# Altium schematic sheet Control_Sig_old.SchDoc
size Letter
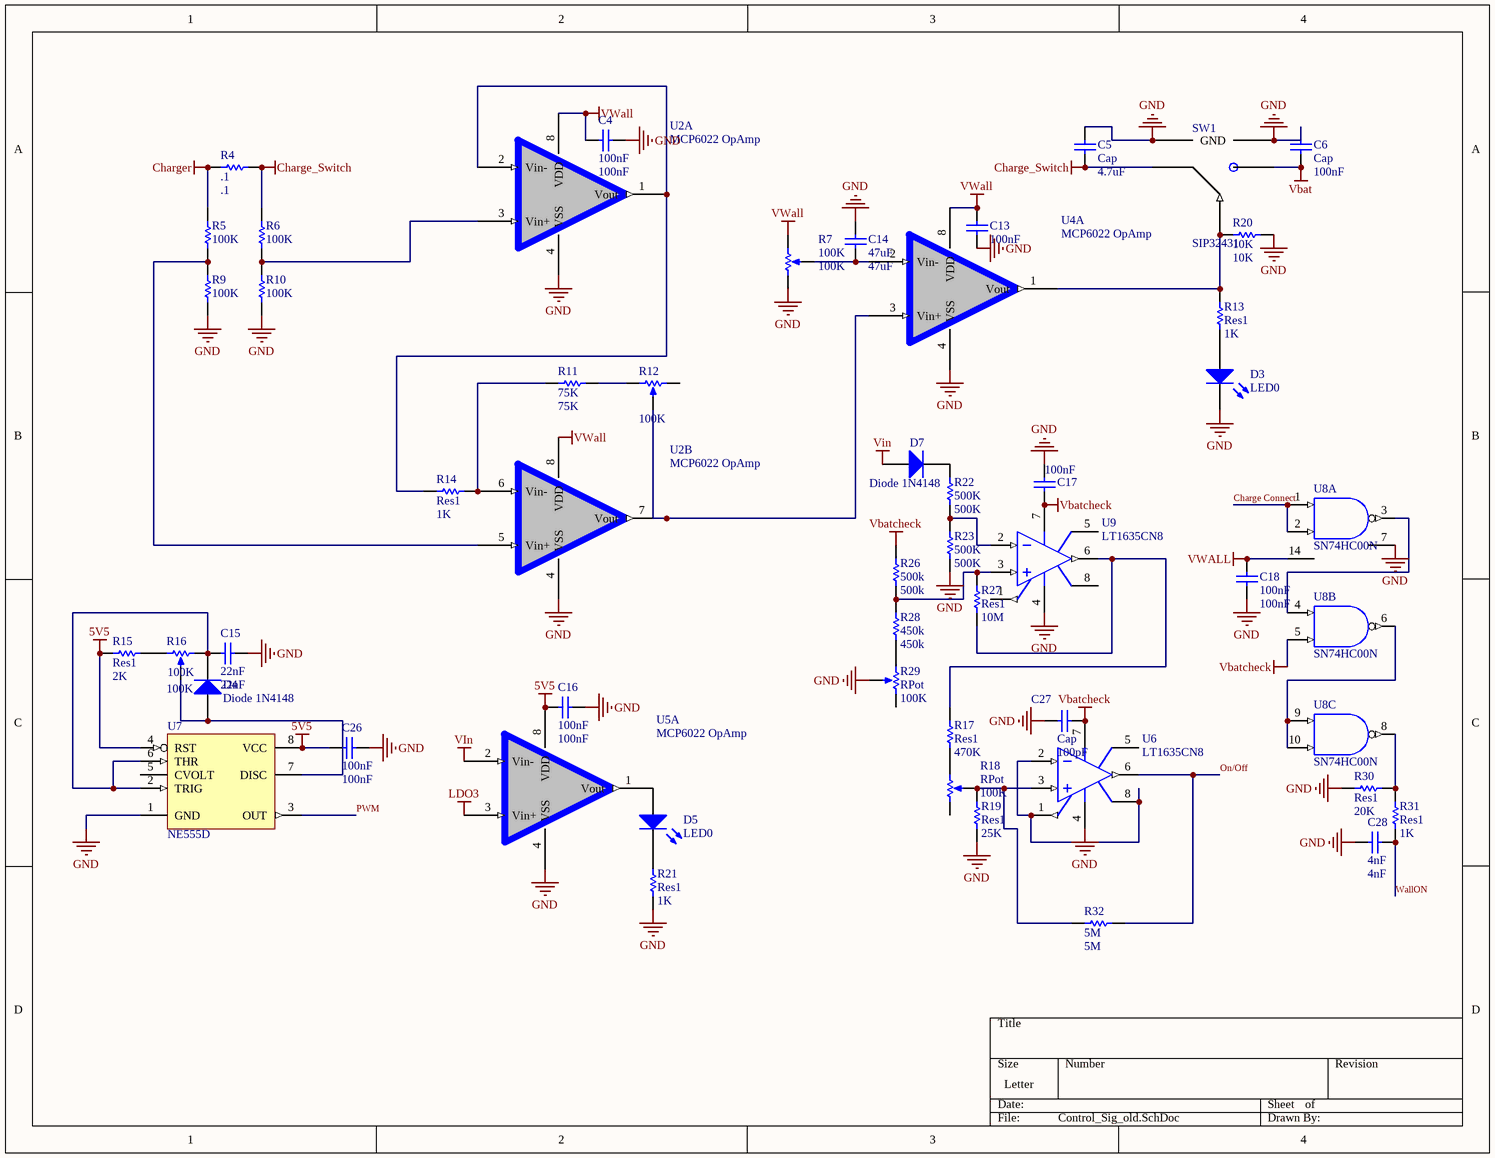
[diagram p0: Control_Sig_old.SchDoc]

## Parts
C4  100nF  [C0805]
C5  Cap  value 4.7uF  [C0805]
C6  Cap  value 100nF  [C0805]
C13  100nF  [C0805]
C14  47uF  [C0805]
C15  22nF  [C0805]
C16  100nF  [C0805]
C17  100nF  [C0805]
C18  100nF  [C0805]
C26  100nF  [C0805]
C27  Cap  value 100pF  [C0805]
C28  4nF  [C0805]
D3  LED0  [LED-0]
D4  Diode 1N4148  [Diode]
D5  LED0  [LED-0]
D7  Diode 1N4148  [Diode]
R4  .1  [6-0805_L]
R5  100K  [6-0805_M]
R6  100K  [6-0805_M]
R7  100K  [POT]
R9  100K  [6-0805_M]
R10  100K  [6-0805_M]
R11  75K  [6-0805_M]
R12  100K  [POT]
R13  Res1  value 1K  [6-0805_M]
R14  Res1  value 1K  [6-0805_M]
R15  Res1  value 2K  [6-0805_M]
R16  100K  [POT]
R17  Res1  value 470K  [6-0805_M]
R18  RPot  value 100K  [POT]
R19  Res1  value 25K  [6-0805_M]
R20  10K  [6-0805_M]
R21  Res1  value 1K  [6-0805_M]
R22  500K  [6-0805_M]
R23  500K  [6-0805_M]
R26  500k  [6-0805_M]
R27  Res1  value 10M  [6-0805_M]
R28  450k  [6-0805_M]
R29  RPot  value 100K  [POT]
R30  Res1  value 20K  [6-0805_M]
R31  Res1  value 1K  [6-0805_M]
R32  5M  [6-0805_M]
SW1  SIP32431  [SOT6 - duplicate]
U2  MCP6022 OpAmp  [SOP8_Opamp]  (parts A,B of 2)
U4  MCP6022 OpAmp  [SOP8_Opamp]  (part A of 2)
U5  MCP6022 OpAmp  [SOP8_Opamp]  (part A of 2)
U6  LT1635CN8  [N8]
U7  NE555D  [D008_N]
U8  SN74HC00N  [N014]  (parts A,B,C of 4)
U9  LT1635CN8  [N8]

## Nets
5V5: C16.1 C26.1 R15.1 U5.8(VDD) U7.4(RST) U7.8(VCC)
Charge_Switch: C5.1 R4.2 R6.2 SW1.4(In)
Charger: R4.1 R5.2
GND: C4.1 C5.2 C6.2 C13.2 C14.2 C15.2 C16.2 C17.2 C18.1 C26.2 C27.1 C28.1 D3.2(K) R7.1(TOP) R9.1 R10.1 R19.1 R20.2 R21.1 R23.1 R29.2(TAP) R30.1 SW1.2(GND) SW1.5(GND) U2.4(VSS) U4.4(VSS) U5.4(VSS) U6.4(V-) U7.1(GND) U8.7(GND) U9.4(V-)
LDO3: U5.3(Vin+)
Vbat: C6.1 SW1.1(Out)
Vbatcheck: C17.1 C27.2 R26.2 U6.7(V+) U8.5(B) U9.7(V+)
VCC: U8.14(VCC)
VIn: D7.A U5.2(Vin-)
VWall: C4.2 C13.1 C18.2 R7.3(BOT) U2.8(VDD) U4.8(VDD) U8.14(VCC)
Charge Connect: U8.1(A) U8.2(B)
On/Off: R32.2 U6.6(OUT)
PWM: U7.3(OUT)
WallON: C28.2 R31.1
NetC14_1: C14.1 R7.2(TAP) U4.2(Vin-)
NetC15_1: C15.1 D4.K R16.3(BOT) U7.2(TRIG) U7.6(THR)
NetD3_1: D3.1(A) R13.1
NetD4_A: D4.A R16.2(TAP) U7.7(DISC)
NetD5_1: D5.1(A) U5.1(Vout)
NetD5_2: D5.2(K) R21.2
NetD7_K: D7.K R22.2
NetR5_1: R5.1 R9.2 U2.5(Vin+)
NetR6_1: R6.1 R10.2 U2.3(Vin+)
NetR11_1: R11.1 R14.2 U2.6(Vin-)
NetR11_2: R11.2 R12.1(TOP)
NetR12_2: R12.2(TAP) U2.7(Vout) U4.3(Vin+)
NetR13_2: R13.2 R20.1 SW1.3 U4.1(Vout)
NetR14_1: R14.1 U2.1(Vout) U2.2(Vin-)
NetR15_2: R15.2 R16.1(TOP)
NetR17_1: R17.1 R18.3(BOT)
NetR17_2: R17.2 R27.1 U9.6(OUT)
NetR18_2: R18.2(TAP) R19.2 R32.1 U6.3(IN+)
NetR22_1: R22.1 R23.2 U9.2(IN-)
NetR26_1: R26.1 R27.2 R28.2 U9.3(IN+)
NetR28_1: R28.1 R29.1(TOP)
NetR30_2: R30.2 R31.2 U8.8(Y)
NetU6_1: U6.1(REFOUT) U6.2(IN-) U6.8(REF_FBK)
NetU8_3: U8.3(Y) U8.4(A)
NetU8_6: U8.6(Y) U8.9(A) U8.10(B)

Not connected (* = marked no-connect by the designer): R12 3(BOT); R18 1(TOP); R29 3(BOT); U6 5(BAL); U7 5(CVOLT); U9 1(REFOUT) 5(BAL) 8(REF_FBK)

## Library data of the parts
C4-C6 C13-C18 C26-C28 = Cap: Capacitor; Published: 8-Jun-2000; LatestRevisionDate: 17-Jul-2002; LatestRevisionNote: Re-released for DXP Platform.; PackageReference: RAD-0.3; Publisher: Altium Limited; PackageDescription: Radial Cap, Thru-Hole; 2 Leads; 0.3 in Pin Spacing
  C4 C13 C16-C18 C26: Value: 100nF
  C14: Value: 47uF
  C15: Value: 22nF
  C28: Value: 4nF
D3 D5 = LED0: Typical INFRARED GaAs LED; Published: 8-Jun-2000; LatestRevisionDate: 08-Jul-2005; LatestRevisionNote: Mech Layer 1 removed.; PackageReference: LED-0; Publisher: Altium Limited; PackageDescription: LED; 2 Leads
D4 D7 = Diode 1N4148: High Conductance Fast Diode; Published: 8-Jun-2000; LatestRevisionDate: 17-Jul-2002; LatestRevisionNote: Re-released for DXP Platform.; DatasheetVersion: 1997; PackageReference: DO-35; Publisher: Altium Limited; PackageDescription: Diode, Axial; Body 3.8 x 1.9 mm (LxDia. max), Lead Dia. 0.53 mm (max); Code_JEDEC: DO-204-AH; ComponentLink1Description: Manufacturer Link; ComponentLink1URL: http://www.fairchildsemi.com/; ComponentLink2Description: Datasheet; ComponentLink2URL: http://www.fairchildsemi.com/ds/1N%2F1N4148.pdf
R4-R6 R9-R11 R13 R14 R17 R19-R23 R26-R28 R30-R32 = Res1: Resistor; Published: 8-Jun-2000; LatestRevisionDate: 17-Jul-2002; LatestRevisionNote: Re-released for DXP Platform.; PackageReference: AXIAL-0.3; Publisher: Altium Limited; PackageDescription: Axial Device, Thru-Hole; 2 Leads; 0.3 in Pin Spacing
  R4: Value: .1
  R5 R6 R9 R10: Value: 100K
  R11: Value: 75K
  R20: Value: 10K
  R22 R23: Value: 500K
  R26: Value: 500k
  R28: Value: 450k
  R32: Value: 5M
R7 R12 R16 R18 R29 = RPot: Potentiometer; Sim Note: Enter the Resistance value and the set point into parameter fields.; Set Position: 0.5; Published: 8-Jun-2000; LatestRevisionDate: 17-Jul-2002; LatestRevisionNote: Re-released for DXP Platform.; PackageReference: VR5; Publisher: Altium Limited; PackageDescription: Variable Resistor, Thru-Hole; 3 Leads
  R7 R12 R16: Value: 100K
R15 = Res1: =value; Published: 8-Jun-2000; LatestRevisionDate: 17-Jul-2002; LatestRevisionNote: Re-released for DXP Platform.; PackageReference: AXIAL-0.3; Publisher: Altium Limited; PackageDescription: Axial Device, Thru-Hole; 2 Leads; 0.3 in Pin Spacing
U6 U9 = LT1635CN8: Micropower Rail-to-Rail Operational Amplifier and Reference; Note: 1479; Published: 8-Jun-2000; LatestRevisionDate: 29-May-2009; LatestRevisionNote: Component Body Added.; DatasheetVersion: 1996; PackageVersion: N8 1002; PackageReference: N8; Publisher: Altium Limited; PackageDescription: DIP, Plastic, 8-Pin, Row Spacing 7.62 mm, Pitch 2.54 mm; ComponentLink1Description: Manufacturer Link; ComponentLink1URL: http://www.linear.com/; ComponentLink2Description: Datasheet; ComponentLink2URL: http://www.linear.com/pc/downloadDocument.do?navId=H0,C1,C1154,C1002,C1243,P1586,D1992
U7 = NE555D: Precision Timer; Published: 16-Jan-2001; LatestRevisionDate: 13-Apr-2006; LatestRevisionNote: IPC-7351 Footprint Added.; DatasheetVersion: Feb-1992; PackageVersion: Jan-1998; PackageReference: D008; Publisher: Altium Limited; PackageDescription: 8-Pin Small Outline Integrated Circuit 1.27 mm Pitch; Code_IPC: SOIC127P600-8; ComponentLink1Description: Manufacturer Link; ComponentLink1URL: http://www.ti.com/; ComponentLink2Description: Datasheet; ComponentLink2URL: http://www-s.ti.com/sc/ds/ne555.pdf
U8 = SN74HC00N: Quadruple 2-Input Positive-NAND Gate; Published: 8-Jun-2000; LatestRevisionDate: 04-Mar-2005; LatestRevisionNote: Stylized 3D Model Added.; DatasheetVersion: May-1997; PackageVersion: Oct-1995; PackageReference: N014; Publisher: Altium Limited; PackageDescription: DIP; 14 Leads; Row Spacing 7.62 mm; Pitch 2.54 mm; ComponentLink1Description: Manufacturer Link; ComponentLink1URL: http://www.ti.com/; ComponentLink2Description: Datasheet; ComponentLink2URL: http://www-s.ti.com/sc/ds/sn74hc00.pdf